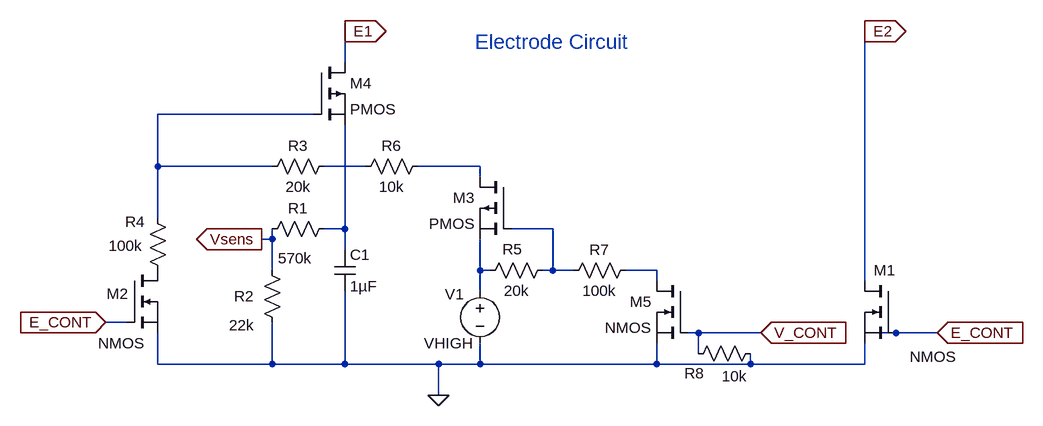
[diagram p0: schematic electrodes.asc]
electrodes.asc, the LTspice schematic file:
Version 4
SHEET 1 920 680
WIRE -272 -192 -272 -208
WIRE 528 -192 528 -208
WIRE -272 -144 -272 -192
WIRE -320 -64 -560 -64
WIRE -560 16 -560 -64
WIRE -384 16 -560 16
WIRE -240 16 -304 16
WIRE -64 16 -160 16
WIRE -64 32 -64 16
WIRE -560 96 -560 16
WIRE -272 112 -272 -48
WIRE -272 112 -304 112
WIRE 48 112 -16 112
WIRE -384 128 -384 112
WIRE -384 128 -400 128
WIRE -272 144 -272 112
WIRE -384 176 -384 128
WIRE -64 176 -64 128
WIRE -48 176 -64 176
WIRE 48 176 48 112
WIRE 48 176 32 176
WIRE 80 176 48 176
WIRE 208 176 160 176
WIRE 208 192 208 176
WIRE 528 192 528 -192
WIRE -64 208 -64 176
WIRE -608 256 -640 256
WIRE 272 272 256 272
WIRE 368 272 272 272
WIRE 576 272 544 272
WIRE 640 272 576 272
WIRE 272 304 272 272
WIRE -560 320 -560 272
WIRE -384 320 -384 256
WIRE -384 320 -560 320
WIRE -272 320 -272 208
WIRE -272 320 -384 320
WIRE -128 320 -272 320
WIRE -64 320 -64 288
WIRE -64 320 -128 320
WIRE 208 320 208 288
WIRE 208 320 -64 320
WIRE 352 320 352 304
WIRE 352 320 208 320
WIRE 528 320 528 288
WIRE 528 320 352 320
WIRE -128 368 -128 320
FLAG -640 256 E_CONT
IOPIN -640 256 In
FLAG 640 272 E_CONT
IOPIN 640 272 In
FLAG -272 -192 E1
IOPIN -272 -192 Out
FLAG 528 -192 E2
IOPIN 528 -192 Out
FLAG -128 368 0
FLAG -400 128 Vsens
IOPIN -400 128 Out
FLAG 368 272 V_CONT
IOPIN 368 272 In
SYMBOL nmos 576 192 M0
WINDOW 0 0 -16 Left 2
WINDOW 3 -93 117 Left 2
SYMATTR InstName M1
SYMBOL res -288 0 R90
WINDOW 0 0 56 VBottom 2
WINDOW 3 32 56 VTop 2
SYMATTR InstName R3
SYMATTR Value 20k
SYMATTR SpiceLine tol=5 pwr=.25w
SYMBOL voltage -64 192 R0
WINDOW 0 -54 21 Left 2
WINDOW 3 -86 96 Left 2
WINDOW 123 0 0 Left 0
WINDOW 39 0 0 Left 0
SYMATTR InstName V1
SYMATTR Value VHIGH
SYMBOL res -288 96 R90
WINDOW 0 0 56 VBottom 2
WINDOW 3 46 61 VTop 2
SYMATTR InstName R1
SYMATTR Value 570k
SYMATTR SpiceLine tol=5 pwr=.25w
SYMBOL pmos -320 -144 R0
SYMATTR InstName M4
SYMBOL pmos -16 32 M0
SYMATTR InstName M3
SYMBOL nmos 256 192 M0
SYMATTR InstName M5
SYMBOL res -400 160 R0
WINDOW 0 -43 56 Left 2
WINDOW 3 -50 100 Left 2
SYMATTR InstName R2
SYMATTR Value 22k
SYMATTR SpiceLine tol=5 pwr=.25w
SYMBOL res -576 80 R0
WINDOW 0 -34 21 Left 2
WINDOW 3 -60 58 Left 2
SYMATTR InstName R4
SYMATTR Value 100k
SYMATTR SpiceLine tol=5 pwr=.25w
SYMBOL res 48 160 R90
WINDOW 0 -1 62 VBottom 2
WINDOW 3 32 56 VTop 2
SYMATTR InstName R5
SYMATTR Value 20k
SYMATTR SpiceLine tol=5 pwr=.25w
SYMBOL res -144 0 R90
WINDOW 0 0 56 VBottom 2
WINDOW 3 32 56 VTop 2
SYMATTR InstName R6
SYMATTR Value 10k
SYMATTR SpiceLine tol=5 pwr=.25w
SYMBOL res 64 192 R270
WINDOW 0 32 56 VTop 2
WINDOW 3 0 56 VBottom 2
SYMATTR InstName R7
SYMATTR Value 100k
SYMATTR SpiceLine tol=5 pwr=.25w
SYMBOL nmos -608 176 R0
WINDOW 0 -31 36 Left 2
WINDOW 3 -44 112 Left 2
SYMATTR InstName M2
SYMBOL cap -288 144 R0
SYMATTR InstName C1
SYMATTR Value 1µF
SYMBOL res 256 320 R270
WINDOW 0 -30 10 VTop 2
WINDOW 3 -3 72 VBottom 2
SYMATTR InstName R8
SYMATTR Value 10k
SYMATTR SpiceLine tol=5 pwr=.25w
TEXT -72 -176 Left 3 ;Electrode Circuit

The netlist it stands for:
* electrodes.asc
M1 E2 E_CONT 0 0 NMOS
R3 N002 N001 20k tol=5 pwr=.25w
V1 N006 0 VHIGH
R1 N004 Vsens 570k tol=5 pwr=.25w
M4 E1 N001 N004 N004 PMOS
M3 N003 N005 N006 N006 PMOS
M5 N007 V_CONT 0 0 NMOS
R2 Vsens 0 22k tol=5 pwr=.25w
R4 N001 P001 100k tol=5 pwr=.25w
R5 N005 N006 20k tol=5 pwr=.25w
R6 N003 N002 10k tol=5 pwr=.25w
R7 N005 N007 100k tol=5 pwr=.25w
M2 P001 E_CONT 0 0 NMOS
C1 N004 0 1µF
R8 V_CONT 0 10k tol=5 pwr=.25w
.model NMOS NMOS
.model PMOS PMOS
.lib standard.mos
* Electrode Circuit
.backanno
.end